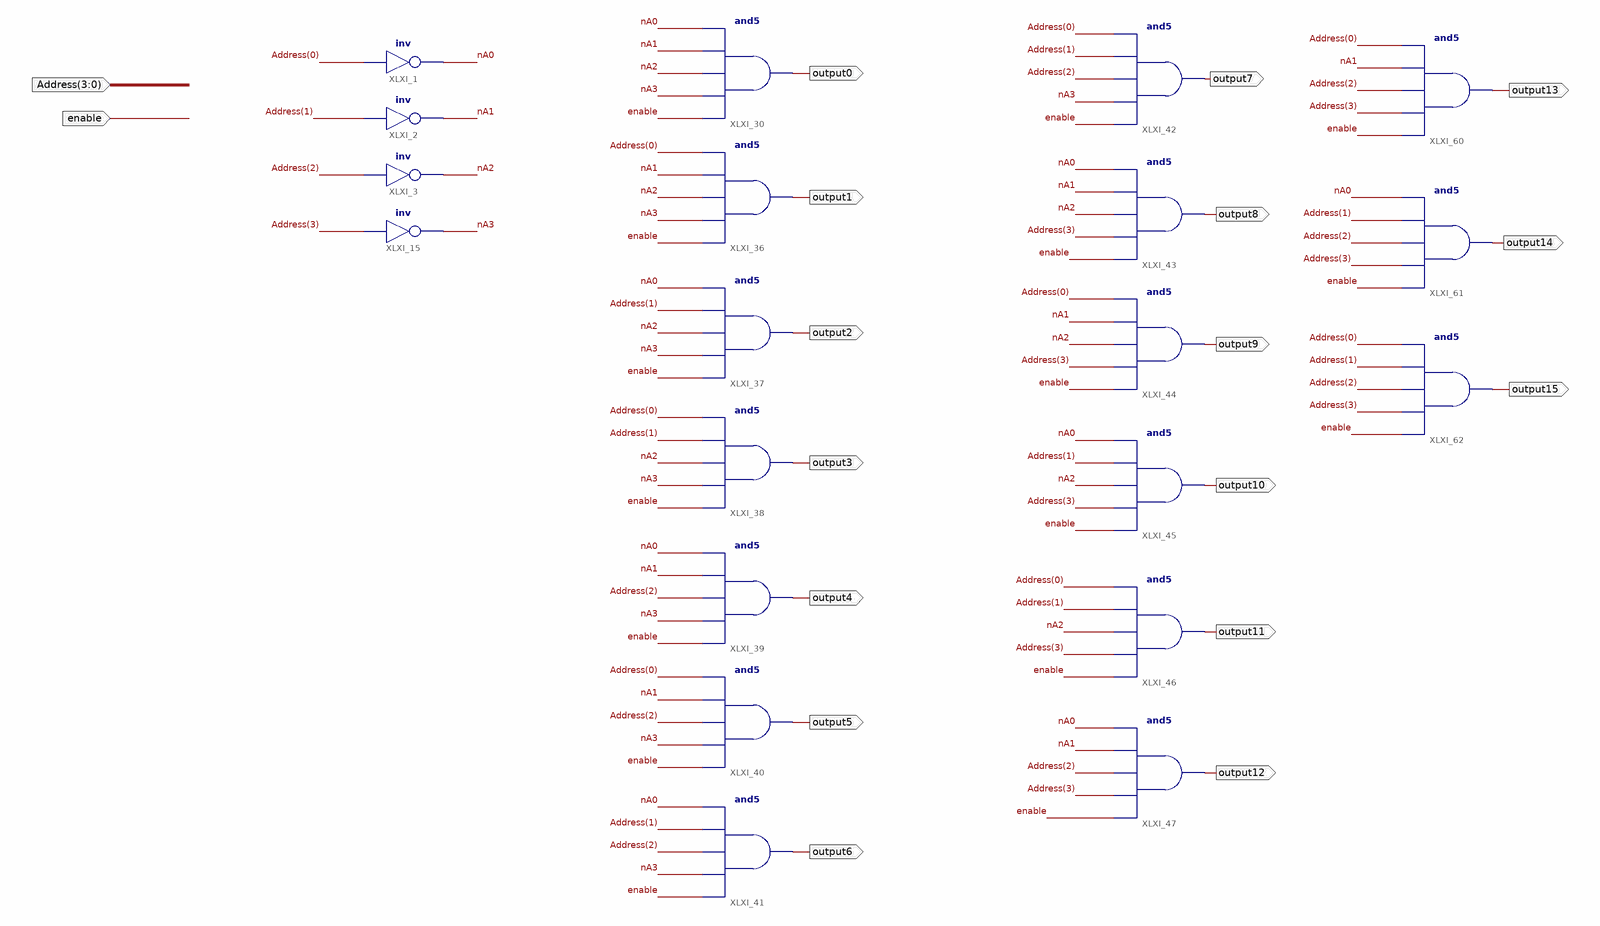
[diagram p0: schematic sheet 1]
// Xilinx ISE schematic decode4b16.sch (spartan3e) as structural Verilog: 20 symbols, 18 ports
module decode4b16 (
  input  enable,
  input  [3:0] Address,
  output output0,
  output output1,
  output output2,
  output output3,
  output output4,
  output output5,
  output output6,
  output output7,
  output output8,
  output output9,
  output output10,
  output output11,
  output output12,
  output output13,
  output output14,
  output output15
);

  wire nA0, nA1, nA2, nA3;

  not XLXI_1 (nA0, Address[0]);
  not XLXI_2 (nA1, Address[1]);
  not XLXI_3 (nA2, Address[2]);
  not XLXI_15 (nA3, Address[3]);
  and XLXI_30 (output0, enable, nA3, nA2, nA1, nA0);
  and XLXI_36 (output1, enable, nA3, nA2, nA1, Address[0]);
  and XLXI_37 (output2, enable, nA3, nA2, Address[1], nA0);
  and XLXI_38 (output3, enable, nA3, nA2, Address[1], Address[0]);
  and XLXI_39 (output4, enable, nA3, Address[2], nA1, nA0);
  and XLXI_40 (output5, enable, nA3, Address[2], nA1, Address[0]);
  and XLXI_41 (output6, enable, nA3, Address[2], Address[1], nA0);
  and XLXI_42 (output7, enable, nA3, Address[2], Address[1], Address[0]);
  and XLXI_43 (output8, enable, Address[3], nA2, nA1, nA0);
  and XLXI_44 (output9, enable, Address[3], nA2, nA1, Address[0]);
  and XLXI_45 (output10, enable, Address[3], nA2, Address[1], nA0);
  and XLXI_46 (output11, enable, Address[3], nA2, Address[1], Address[0]);
  and XLXI_47 (output12, enable, Address[3], Address[2], nA1, nA0);
  and XLXI_60 (output13, enable, Address[3], Address[2], nA1, Address[0]);
  and XLXI_61 (output14, enable, Address[3], Address[2], Address[1], nA0);
  and XLXI_62 (output15, enable, Address[3], Address[2], Address[1], Address[0]);
endmodule
